# EasyEDA Pro project car1.eprj, schematic Schematic8
Board Name: V2.0-主控板; Create Date: 2025-06-19; Page Name: P1; Project Name: car1; Schematic Name: Schematic8; Update Date: 2025-06-20; Company: 嘉立创EDA; Page Size: A4; Version: V1.0
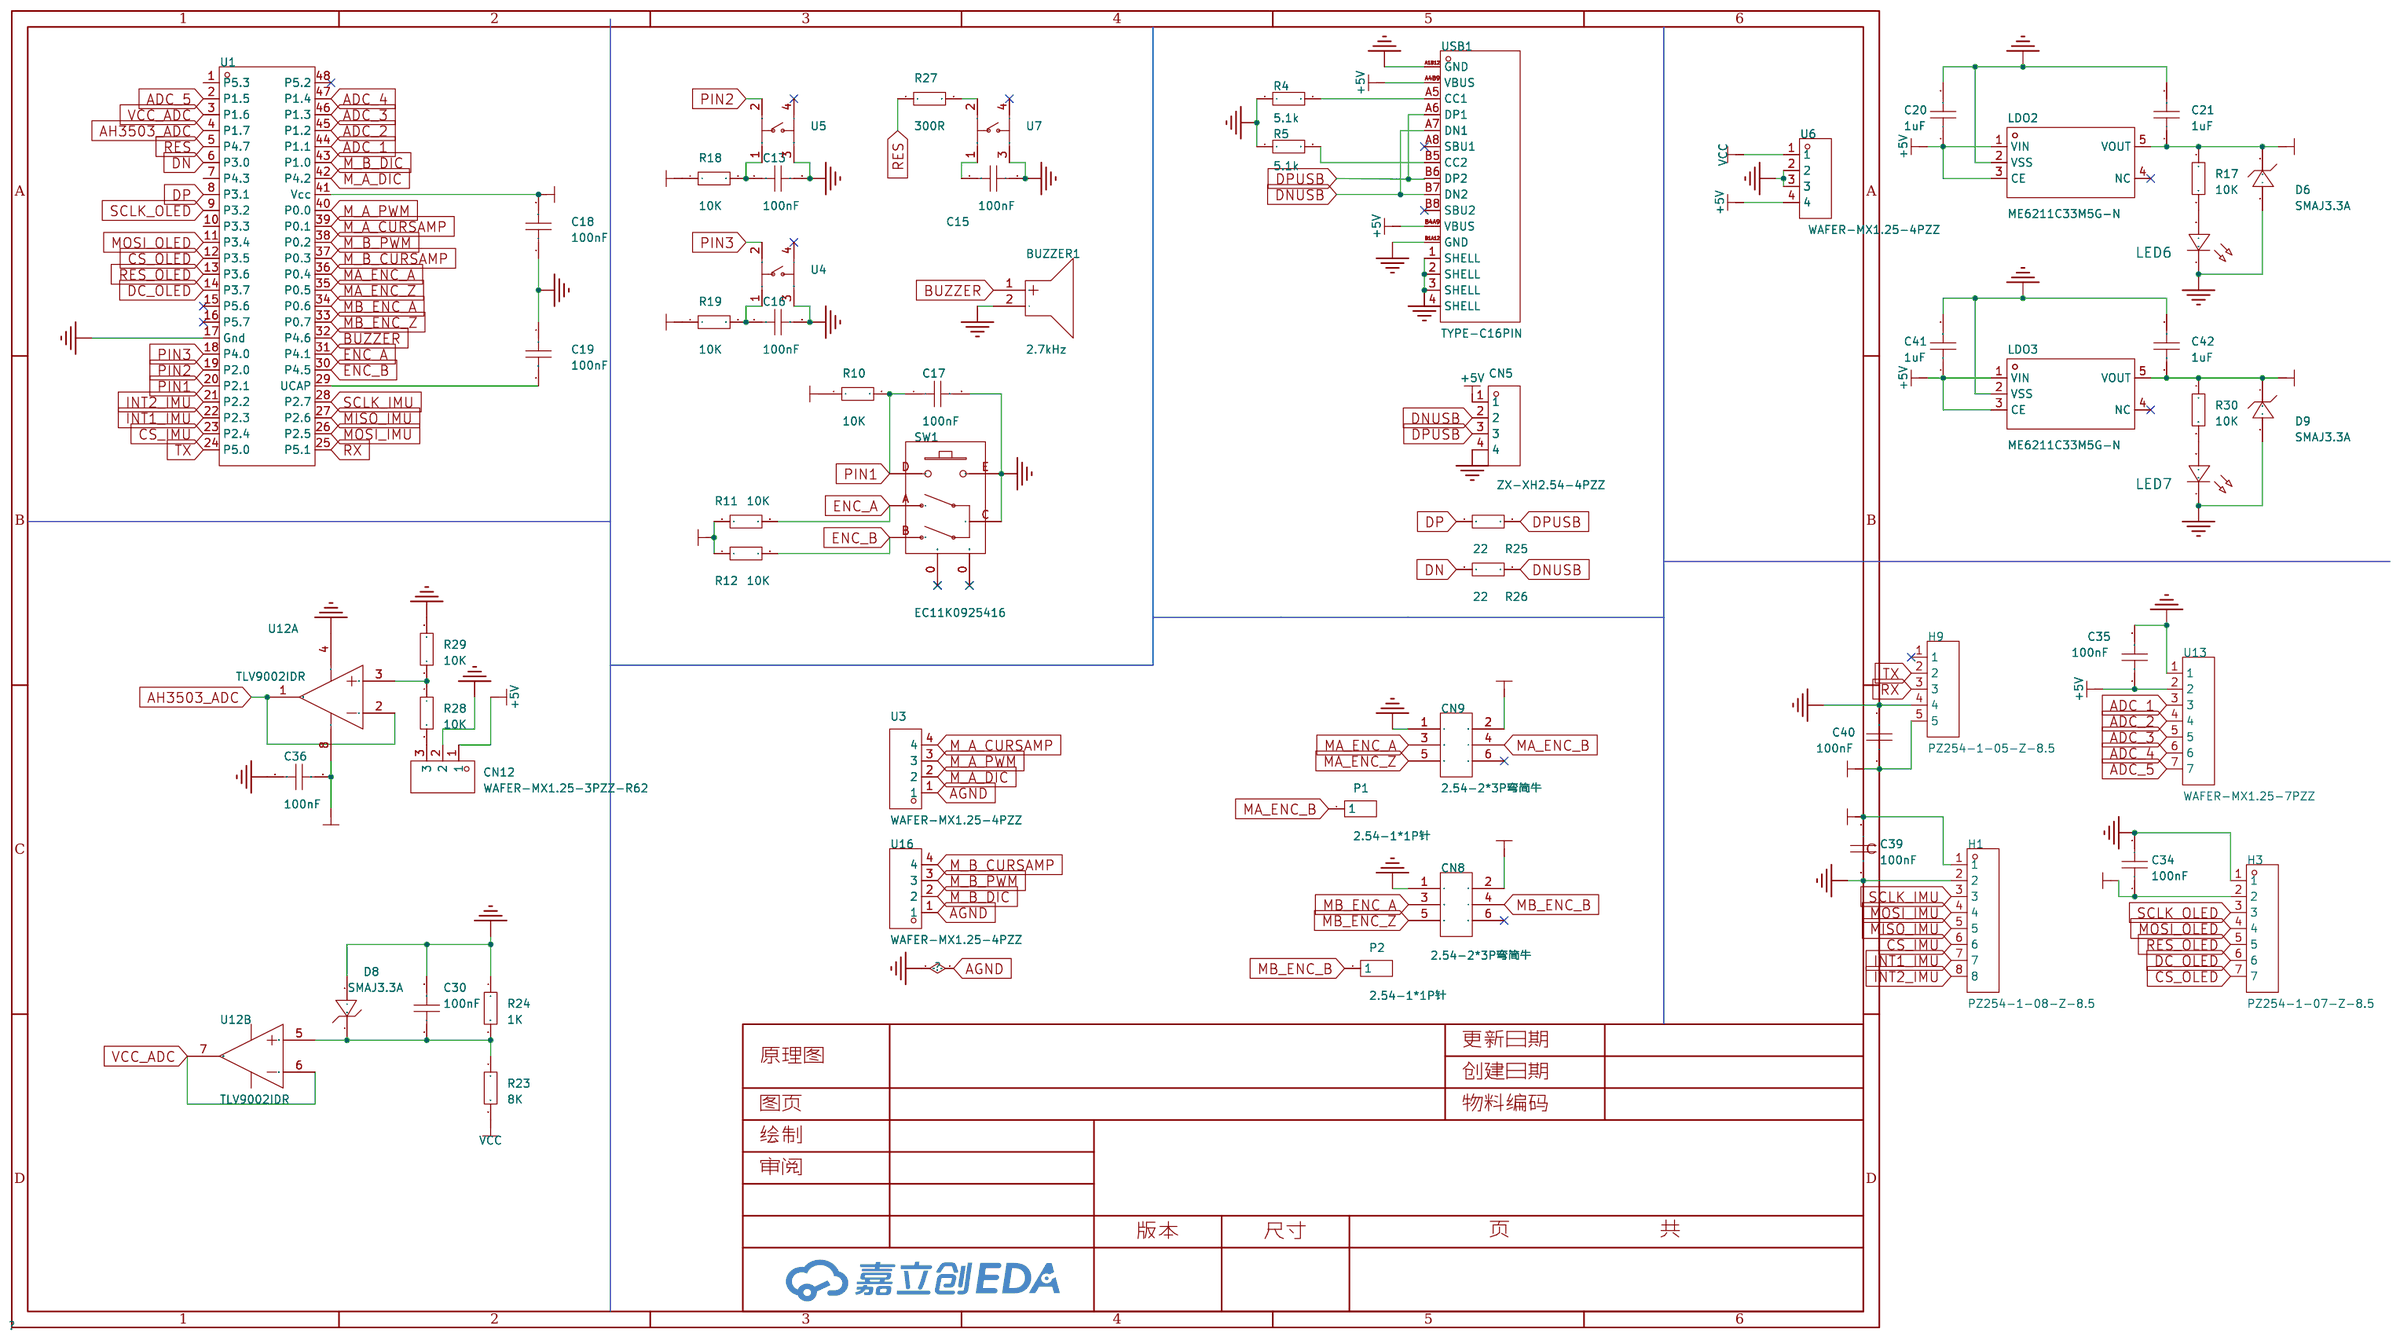
[diagram p12: schematic sheet]

## Parts
BUZZER1  2.7kHz  [BUZ-SMD_L9.6-W9.6-LS10.0-R]
C13  100nF  [C0603]
C15  100nF  [C0603]
C16  100nF  [C0603]
C17  100nF  [C0603]
C18  100nF  [C0603]
C19  100nF  [C0603]
C20  1uF  [C0603]
C21  1uF  [C0603]
C30  100nF  [C0603]
C34  100nF  [C0603]
C35  100nF  [C0603]
C36  100nF  [C0603]
C39  100nF  [C0603]
C40  100nF  [C0603]
C41  1uF  [C0603]
C42  1uF  [C0603]
CN5  ZX-XH2.54-4PZZ  [CONN-TH_4P-P2.50_4PIN]
CN8  2.54-2*3P弯简牛  [IDC-TH_6P-P2.54-H-R2-C3-S2.54]
CN9  2.54-2*3P弯简牛  [IDC-TH_6P-P2.54-H-R2-C3-S2.54]
CN12  WAFER-MX1.25-3PZZ-R62  [CONN-TH_3P-P1.25_WAFER-MX1.25-3PZZ]
D6  SMAJ3.3A  [SMA_L4.3-W2.7-LS5.1-RD]
D8  SMAJ3.3A  [SMA_L4.3-W2.7-LS5.1-RD]
D9  SMAJ3.3A  [SMA_L4.3-W2.7-LS5.1-RD]
H1  PZ254-1-08-Z-8.5  [HDR-TH_8P-P2.54-V-M]
H3  PZ254-1-07-Z-8.5  [HDR-TH_07P-P2.54-V-M]
H9  PZ254-1-05-Z-8.5  [HDR-TH_5P-P2.54-V-M]
LDO2  ME6211C33M5G-N  [SOT-23-5_L3.0-W1.7-P0.95-LS2.8-BL]
LDO3  ME6211C33M5G-N  [SOT-23-5_L3.0-W1.7-P0.95-LS2.8-BL]
LED6  -  [LED_0603]
LED7  -  [LED_0603]
P1  2.54-1*1P针  [HDR-TH_1P-P2.54-V-M]
P2  2.54-1*1P针  [HDR-TH_1P-P2.54-V-M]
R4  5.1k  [R0603]
R5  5.1k  [R0603]
R10  10K  [R0603]
R11  10K  [R0603]
R12  10K  [R0603]
R17  10K  [R0603]
R18  10K  [R0603]
R19  10K  [R0603]
R23  8K  [R0603]
R24  1K  [R0603]
R25  22  [R0603]
R26  22  [R0603]
R27  300R  [R0603]
R28  10K  [R0603]
R29  10K  [R0603]
R30  10K  [R0603]
SW1  EC11K0925416  [SW-TH_EC11K0925416]
U1  AI8051U-34K64-QFP48  [LQFP-48_L7.0-W7.0-P0.50-LS9.0-BL_1]
U3  WAFER-MX1.25-4PZZ  [CONN-TH_4P-P1.25_WAFER-MX1.25-4PZZ]
U4  TC-6610 6*6*5 160g  [SW-TH_4P-L6.0-W6.0-P4.50-LS6.5]
U5  TC-6610 6*6*5 160g  [SW-TH_4P-L6.0-W6.0-P4.50-LS6.5]
U6  WAFER-MX1.25-4PZZ  [CONN-TH_4P-P1.25_WAFER-MX1.25-4PZZ]
U7  TC-6610 6*6*5 160g  [SW-TH_4P-L6.0-W6.0-P4.50-LS6.5]
U12  TLV9002IDR  [SOIC-8_L4.9-W3.9-P1.27-LS6.0-BL]  (sections 1,2)
U13  WAFER-MX1.25-7PZZ  [CONN-TH_7P-P1.25_XUNPU_WAFER-MX1.25-7PZZ]
U16  WAFER-MX1.25-4PZZ  [CONN-TH_4P-P1.25_WAFER-MX1.25-4PZZ]
USB1  TYPE-C16PIN  [USB-C-SMD_TYPE-C16PIN]

## Library data of the parts
BUZZER1 = YS-SBZ9650DYB05: 驱动方式:有源(内含驱动线路);频率:2.7kHz;声压(SPL):80dB;; LCSC Part Name: 贴片有源蜂鸣器5V; Supplier Part: C409830; Manufacturer: Fengming(锋鸣电子); Supplier Footprint: SMD,9.6x9.6mm; JLCPCB Part Class: 扩展库; Datasheet: https://atta.szlcsc.com/upload/public/pdf/source/20191217/C409830_8EC3C70066086F723D62F9967ED58A07.pdf; Supplier: LCSC; Driver Circuitry: 有源(内含驱动线路); Voltage - Supply: 3V~7V; Sound Pressure Level(SPL): 80dB; Length: 9.6mm; Width: 9.6mm; Height: 5.3mm
C13 C15-C21 C41 C42 = CAP_0402: Supplier Footprint: 0402
C30 C34-C36 C39 C40 = CAP_0603: Supplier Footprint: 0603
CN5 = ZX-XH2.54-4PZZ: 插针结构:1x4P;间距:2.54mm;安装方式:直插;参考系列:XH;总PIN数:4P;排数:1;每排PIN数:4;行距:-;额定电流:3A;触头材质:黄铜;触头镀层:锡;工作温度范围:-25℃~+85℃;; Supplier Part: C7429634; Manufacturer: Megastar(兆星); Supplier Footprint: 插件,P=2.5mm; JLCPCB Part Class: 扩展库; Datasheet: https://atta.szlcsc.com/upload/public/pdf/source/20230619/B529A2163E0159A644AB3383D208FB03.pdf; Supplier: LCSC; Pins Structure: 1x4P; Pitch: 2.54mm; Mounting Style: 直插; Reference Series: XH; Number of Pins: 4P; Number of Rows: 1; Number of PINs Per Row: 4; Current Rating (Max): 3A; Contact Material: 黄铜; Contact Plating: 锡; Operating Temperature Range: -25℃~+85℃
CN8 CN9 = 2.54-2*3P弯简牛: 连接器类型:简牛座;间距:2.54mm;结构:2x3P;封装形式:弯插;行距:2.54mm;排数:2;每排PIN数:3;触头材质:-;触头镀层:-;; LCSC Part Name: 2.54mm 2x3P 排数:2 每排P数:3; Supplier Part: C34945; Manufacturer: BOOMELE(博穆精密); Supplier Footprint: 弯插,P=2.54mm; JLCPCB Part Class: 扩展库; Datasheet: https://atta.szlcsc.com/upload/public/pdf/source/20151118/1457707580629.pdf; Supplier: LCSC; Connector Type: 简牛座; Pitch: 2.54mm; Structure: 2x3P; Holder Type: 弯插; Row Spacing: 2.54mm; Number of Rows: 2; Pin Number in each Row: 3
CN12 = WAFER-MX1.25-3PZZ-R62: 插针结构:1x3P;间距:1.25mm;安装方式:直插;参考系列:PicoBlade(MX 1.25);总PIN数:3P;排数:1;每排PIN数:3;行距:-;额定电流:-;触头材质:铜合金;触头镀层:锡;工作温度:-25℃~+85℃;; LCSC Part Name: 1x3P 间距:1.25mm 直插 系列:PicoBlade(MX 1.25); Supplier Part: C22390408; Manufacturer: XUNPU(讯普); Supplier Footprint: 插件,P=1.25mm; JLCPCB Part Class: 扩展库; Datasheet: https://atta.szlcsc.com/upload/public/pdf/source/20240428/D061562BA5A9714D4862CFA880116A9B.pdf; Supplier: LCSC; Pins Structure: 1x3P; Pitch: 1.25mm; Mounting Type: 直插; Reference Series: PicoBlade(MX 1.25); Number of Pins: 3P; Number of Rows: 1; Number of PINs Per Row: 3; Contact Material: 铜合金; Contact Plating: 锡; Operating Temperature: -25℃~+85℃; Voltage Rating: 125V; Plastic Material: PA66; Flame Retardant Rating: UL94V-2; Color: 红色; Z-Height of the Board: 4.7mm; Y-Width of Bottom Edge on Board: 3.2mm
D6 D8 D9 = SMAJ3.3A: 反向截止电压(Vrwm):3.3V;钳位电压:8.3V;峰值脉冲电流(Ipp):25A;击穿电压:4.2V;; LCSC Part Name: 单向TVS 3.3V截止 25A峰值脉冲; Supplier Part: C2917853; Manufacturer: ZHIDE(志得); Supplier Footprint: SMA; JLCPCB Part Class: 扩展库; Datasheet: https://atta.szlcsc.com/upload/public/pdf/source/20211123/CCA4B0E600B5A566CDC39785DC4CF110.pdf; Supplier: LCSC; Reverse Stand-Off Voltage (Vrwm): 3.3V; Clamping Voltage: 8.3V; Peak Pulse Current (Ipp): 25A; Voltage - Breakdown: 4.2V; Reverse Leakage Current (Ir): 200uA; Type: TVS
H1 = PZ254-1-08-Z-8.5: 插针结构:1x8P;间距:2.54mm;行距:-;圆针/方针:方针;安装类型:直插;排数:单排;总PIN位数:8P;额定电流:3A;额定电压:-;配合针长度:6mm;塑高:2.5mm;端接针长度:3mm;触头材质:黄铜;工作温度范围:-40℃~+105℃;焊接温度(最大值):260℃@10S;颜色:黑色;; LCSC Part Name: 1x8P 间距:2.54mm 方针 直插; Supplier Part: C2894931; Manufacturer: HCTL(华灿天禄); Supplier Footprint: 插件,P=2.54mm; JLCPCB Part Class: 扩展库; Datasheet: https://atta.szlcsc.com/upload/public/pdf/source/20240305/0F0A2A5C422E5D195558C9C26715A031.pdf; Supplier: LCSC; Pin Structure: 1x8P; Pitch: 2.54mm; Circluar Pins/Square Pins: 方针; Mounting Type: 直插; Number of Rows: 单排; Number of Pins: 8P; Current Rating (Max): 3A; Length of Mating Pin: 6mm; Insulation Height: 2.5mm; Length of End Connection Pin: 3mm; Contact Material: 黄铜; Operating Temperature Range: -40℃~+105℃; Soldering Temperature(Max): 260℃@10S; Color: 黑色
H3 = PZ254-1-07-Z-8.5: 插针结构:1x7P;间距:2.54mm;行距:-;圆针/方针:方针;安装类型:直插;排数:单排;总PIN位数:7P;额定电流:3A;额定电压:-;配合针长度:6mm;塑高:2.5mm;端接针长度:3mm;触头材质:黄铜;工作温度范围:-40℃~+105℃;焊接温度(最大值):260℃@10S;颜色:黑色;; LCSC Part Name: 1x7P 间距:2.54mm 方针 直插; Supplier Part: C2894930; Manufacturer: HCTL(华灿天禄); Supplier Footprint: 插件,P=2.54mm; JLCPCB Part Class: 扩展库; Datasheet: https://atta.szlcsc.com/upload/public/pdf/source/20240305/0F0A2A5C422E5D195558C9C26715A031.pdf; Supplier: LCSC; Pin Structure: 1x7P; Pitch: 2.54mm; Circluar Pins/Square Pins: 方针; Mounting Type: 直插; Number of Rows: 单排; Number of Pins: 7P; Current Rating (Max): 3A; Length of Mating Pin: 6mm; Insulation Height: 2.5mm; Length of End Connection Pin: 3mm; Contact Material: 黄铜; Operating Temperature Range: -40℃~+105℃; Soldering Temperature(Max): 260℃@10S; Color: 黑色
H9 = PZ254-1-05-Z-8.5: 插针结构:1x5P;间距:2.54mm;行距:-;圆针/方针:方针;安装方式:直插;排数:单排;总PIN位数:5P;额定电流:3A;额定电压:-;配合针长度:6mm;塑高:2.5mm;端接针长度:3mm;触头材质:黄铜;工作温度:-40℃~+105℃;颜色:黑色;; LCSC Part Name: 1x5P 间距:2.54mm 方针 直插; Supplier Part: C2894928; Manufacturer: HCTL(华灿天禄); Supplier Footprint: 插件,P=2.54mm; JLCPCB Part Class: 扩展库; Datasheet: https://atta.szlcsc.com/upload/public/pdf/source/20240305/0F0A2A5C422E5D195558C9C26715A031.pdf; Supplier: LCSC; Pin Structure: 1x5P; Pitch: 2.54mm; Circluar Pins/Square Pins: 方针; Mounting Type: 直插; Number of Rows: 单排; Number of Pins: 5P; Current Rating: 3A; Length of Mating Pin: 6mm; Insulation Height: 2.5mm; Length of End Connection Pin: 3mm; Contact Material: 黄铜; Operating Temperature: -40℃~+105℃; Color: 黑色
LDO2 LDO3 = ME6211C33M5G-N: 输出类型:固定;最大输入电压:6V;输出电压:3.3V;最大输出电流:500mA;电源纹波抑制比(PSRR):70dB;输出极性:正极;; LCSC Part Name: 输入6V 输出3.3V 500mA; Supplier Part: C82942; Manufacturer: MICRONE(南京微盟); Supplier Footprint: SOT-23-5; JLCPCB Part Class: 扩展库; Datasheet: https://atta.szlcsc.com/upload/public/pdf/source/20170918/C82942_1505727073070976520.pdf; Supplier: LCSC; Output Type: 固定; Maximum Input Voltage: 6V; Output Voltage: 3.3V; MAX Output Current: 500mA; Power Supply Rejection Ratio (PSRR): 70dB; Dropout Voltage: 260mV@(200mA); Output Polarity: 正极; Number of Outputs: 1
LED6 LED7 = LED_0603-R: Supplier Footprint: 0603
P1 P2 = 2.54-1*1P针: 插针结构:-;间距:-;行距:-;圆针/方针:-;安装方式:直插;排数:单排;总PIN位数:1P;额定电流:-;额定电压:-;配合针长度:-;塑高:-;触头材质:-;触头镀层:-;颜色:黑色;; LCSC Part Name: 直插; Supplier Part: C81276; Manufacturer: BOOMELE(博穆精密); Supplier Footprint: 插件,P=2.54mm; JLCPCB Part Class: 扩展库; Datasheet: https://atta.szlcsc.com/upload/public/pdf/source/20221018/3E9408392E35E6F57A28985E5F7BF5C9.pdf; Supplier: LCSC; Mounting Type: 直插; Number of Rows: 单排; Number of Pins: 1P; Color: 黑色
R4 R5 R10-R12 R17 R30 = Res_0402: Supplier Footprint: 0402
R18 R19 R23-R29 = Res_0603: Supplier Footprint: 0603
SW1 = EC11K0925416: Supplier Part: C219777; Manufacturer: ALPSALPINE(阿尔卑斯阿尔派); Supplier Footprint: 插件; JLCPCB Part Class: 扩展库; Datasheet: https://atta.szlcsc.com/upload/public/pdf/source/20220222/29C2476E448AF88AA1E99A46D9435970.pdf; Supplier: LCSC
U1 = AI8051U-34K64-QFP48: 硬件浮点/硬件三角函数 跑100MHz, 32位8051-CPU 跑 42MHz，PWM 有硬件移相功能，DMA支持外设到外设，DMA支持PWM; Supplier Part: C41427635; Manufacturer: STC; Supplier Footprint: QFP-48; JLCPCB Part Class: 扩展库; Datasheet: https://atta.szlcsc.com/upload/public/pdf/source/20241012/98E0A3F17C9CC280218AE3F266CCDE47.pdf; Supplier: LCSC
U3 U6 U16 = WAFER-MX1.25-4PZZ: 插针结构:1x4P;间距:1.25mm;安装方式:直插;参考系列:PicoBlade(MX 1.25);总PIN数:4P;排数:1;每排PIN数:4;行距:-;额定电流:1A;触头材质:黄铜;触头镀层:-;工作温度:-25℃~+85℃;; LCSC Part Name: 1x4P 间距:1.25mm 直插 系列:PicoBlade(MX 1.25); Supplier Part: C3029397; Manufacturer: XUNPU(讯普); Supplier Footprint: 插件,P=1.25mm; JLCPCB Part Class: 扩展库; Datasheet: https://atta.szlcsc.com/upload/public/pdf/source/20220527/74EE44A637E2E6AE073051F308D41465.pdf; Supplier: LCSC; Pins Structure: 1x4P; Pitch: 1.25mm; Mounting Type: 直插; Reference Series: PicoBlade(MX 1.25); Number of Pins: 4P; Number of Rows: 1; Number of PINs Per Row: 4; Current Rating: 1A; Contact Material: 黄铜; Operating Temperature: -25℃~+85℃; Voltage Rating: 125V; Plastic Material: LCP; Color: 米色; Z-Height of the Board: 4.6mm; Y-Width of Bottom Edge on Board: 3.3mm
U4 U5 U7 = TC-6610 6*6*5 160g: 轻触开关  6*6*5 160g力 4.3基座 复银 耐温 ROHS; Supplier Part: C7528706; Manufacturer: FG(富港); Supplier Footprint: 插件,6x6mm; JLCPCB Part Class: 扩展库; Datasheet: https://atta.szlcsc.com/upload/public/pdf/source/20240119/C4B5B07B03893BE63D1CA58047A0B7F3.pdf; Supplier: LCSC
U12 = TLV9002IDR: 放大器数:双路;轨到轨:-;增益带宽积(GBP):-;输入失调电压(Vos):1.6mV;压摆率(SR):2V/us;输入偏置电流(Ib):5pA;; Supplier Part: C398360; Manufacturer: TI(德州仪器); Supplier Footprint: SOIC-8; JLCPCB Part Class: 扩展库; Datasheet: https://www.ti.com/cn/lit/gpn/tlv9001; Supplier: LCSC; Number of Channels: 双路; Maximum Power Supply Range (Vdd-Vss): 5.5V; Vos - Input Offset Voltage: 1.6mV; Input Offset Voltage Drift(Vos TC): 0.6uV/℃; Slew Rate: 2V/us; Ib - Input Bias Current: 5pA; Noise density(eN): 4.7nV/√Hz@1kHz; Common Mode Rejection Ratio(CMRR): 86dB; Operating Temperature: -40℃~+125℃; Single supply: 1.8V~5.5V
U13 = WAFER-MX1.25-7PZZ: 插针结构:1x7P;间距:1.25mm;安装方式:直插;参考系列:PicoBlade(MX 1.25);总PIN数:7P;排数:1;每排PIN数:7;行距:-;额定电流:1A;触头材质:黄铜;触头镀层:-;工作温度:-25℃~+85℃;; LCSC Part Name: 1x7P 间距:1.25mm 直插 系列:PicoBlade(MX 1.25); Supplier Part: C3029400; Manufacturer: XUNPU(讯普); Supplier Footprint: 插件,P=1.25mm; JLCPCB Part Class: Extended Part; Datasheet: https://atta.szlcsc.com/upload/public/pdf/source/20220527/74EE44A637E2E6AE073051F308D41465.pdf; Supplier: LCSC; Pins Structure: 1x7P; Pitch: 1.25mm; Mounting Type: 直插; Reference Series: PicoBlade(MX 1.25); Number of Pins: 7P; Number of Rows: 1; Number of PINs Per Row: 7; Current Rating: 1A; Contact Material: 黄铜; Operating Temperature: -25℃~+85℃; Voltage Rating: 125V; Plastic Material: LCP; Color: 米色; Z-Height of the Board: 4.6mm; Y-Width of Bottom Edge on Board: 3.3mm
USB1 = TYPE-C16PIN: 连接器类型:Type-C;标准:USB 3.1;公母:母;安装方式:卧贴;触点数量:16P;端口数量:1;额定电流 - 电源:3A;工作温度范围:-40℃~+85℃;; LCSC Part Name: Type-C 母 卧贴; Supplier Part: C393939; Manufacturer: SHOU HAN(首韩); Supplier Footprint: SMD; JLCPCB Part Class: 扩展库; Datasheet: https://atta.szlcsc.com/upload/public/pdf/source/20190521/C393939_7B9043D4CF1026AF443AB60D91FBCD5C.pdf; Supplier: LCSC; Connector Type: Type-C; Standard: USB 3.1; Gender: 母; Mounting Style: 卧贴; Number of Contacts: 16P; Number of Ports: 1; Current Rating - Power (Max): 3A; Operating Temperature Range: -40℃~+85℃; Rated Voltage (Max): 30V; Connect-Disconnect Life: 1万次; Core Colour: 黑色

## Nets
3.3V: C21.1 C39.2 C40.1 CN8.2 CN9.2 D6.1(C) H1.1 H9.5 LDO2.5(VOUT) R17.1
3.3V_1: C18.2 C34.1 C36.2 C42.1 D9.1(C) H3.2 LDO3.5(VOUT) R10.1 R11.1 R12.1 R18.1 R19.1 R30.1 U1.41(Vcc) U12.8(V+)
+5V: C20.1 C35.1 C41.1 CN5.1 CN12.1 LDO2.1(VIN) LDO2.3(CE) LDO3.1(VIN) LDO3.3(CE) U6.4 U13.2 USB1.A4B9(VBUS) USB1.B4A9(VBUS)
GND: BUZZER1.2(-) C13.2 C15.2 C16.2 C17.2 C18.1 C19.1 C20.2 C21.2 C30.2 C34.2 C35.2 C36.1 C39.1 C40.2 C41.2 C42.2 CN5.4 CN8.1 CN9.1 CN12.2 D6.2(A) D8.2(A) D9.2(A) H1.2 H3.1 H9.4 LDO2.2(VSS) LDO3.2(VSS) LED6.1(C) LED7.1(C) R4.1 R5.1 R24.1 R29.2 SW1.C SW1.E U1.17(Gnd) U3.1 U4.3 U5.3 U6.2 U6.3 U7.3 U12.4(V-) U13.1 U16.1 USB1.1(SHELL) USB1.2(SHELL) USB1.3(SHELL) USB1.4(SHELL) USB1.A1B12(GND) USB1.B1A12(GND)
VCC: R23.2 U6.1
VCC_ADC: U1.3(P1.6) U12.6(IN2-) U12.7(OUT2)
ADC_1: U1.44(P1.1) U13.3
ADC_2: U1.45(P1.2) U13.4
ADC_3: U1.46(P1.3) U13.5
ADC_4: U1.47(P1.4) U13.6
ADC_5: U1.2(P1.5) U13.7
AH3503_ADC: U1.4(P1.7) U12.1(OUT1) U12.2(IN1-)
BUZZER: BUZZER1.1(+) U1.32(P4.6)
CS_IMU: H1.6 U1.23(P2.4)
CS_OLED: H3.7 U1.12(P3.5)
DC_OLED: H3.6 U1.14(P3.7)
DN: R26.1 U1.6(P3.0)
DNUSB: CN5.2 R26.2 USB1.A7(DN1) USB1.B7(DN2)
DP: R25.1 U1.8(P3.1)
DPUSB: CN5.3 R25.2 USB1.A6(DP1) USB1.B6(DP2)
ENC_A: R11.2 SW1.A U1.31(P4.1)
ENC_B: R12.2 SW1.B U1.30(P4.5)
INT1_IMU: H1.7 U1.22(P2.3)
INT2_IMU: H1.8 U1.21(P2.2)
M_A_CURSAMP: U1.39(P0.1) U3.4
M_A_DIC: U1.42(P4.2) U3.2
M_A_PWM: U1.40(P0.0) U3.3
M_B_CURSAMP: U1.37(P0.3) U16.4
M_B_DIC: U1.43(P1.0) U16.2
M_B_PWM: U1.38(P0.2) U16.3
MA_ENC_A: CN9.3 U1.36(P0.4)
MA_ENC_B: CN9.4 P1.1
MA_ENC_Z: CN9.5 U1.35(P0.5)
MB_ENC_A: CN8.3 U1.34(P0.6)
MB_ENC_B: CN8.4 P2.1
MB_ENC_Z: CN8.5 U1.33(P0.7)
MISO_IMU: H1.5 U1.27(P2.6)
MOSI_IMU: H1.4 U1.26(P2.5)
MOSI_OLED: H3.4 U1.11(P3.4)
PIN1: C17.1 R10.2 SW1.D U1.20(P2.1)
PIN2: U1.19(P2.0) U5.2
PIN3: U1.18(P4.0) U4.2
RES: R27.1 U1.5(P4.7)
RES_OLED: H3.5 U1.13(P3.6)
RX: H9.3 U1.25(P5.1)
SCLK_IMU: H1.3 U1.28(P2.7)
SCLK_OLED: H3.3 U1.9(P3.2)
TX: H9.2 U1.24(P5.0)
$1N3270: R4.2 USB1.A5(CC1)
$1N3271: R5.2 USB1.B5(CC2)
$1N3293: C19.2 U1.29(UCAP)
$1N3342: R28.1 R29.1 U12.3(IN1+)
$1N4208: C30.1 D8.1(C) R23.1 R24.2 U12.5(IN2+)
Net-(C13-1): C13.1 R18.2 U5.1
Net-(C15-1): C15.1 U7.1
Net-(C16-1): C16.1 R19.2 U4.1
Net-(CN12-3): CN12.3 R28.2
Net-(LED6-2): LED6.2(A) R17.2
Net-(LED7-2): LED7.2(A) R30.2
Net-(R27-2): R27.2 U7.2

Not connected (* = marked no-connect by the designer): CN8 6*; CN9 6*; H9 1*; LDO2 4(NC)*; LDO3 4(NC)*; SW1 0(MH1)*; U1 1(P5.3) 7(P4.3) 10(P3.3) 15(P5.6)* 16(P5.7)* 48(P5.2)*; U4 4*; U5 4*; U7 4*; USB1 A8(SBU1)* B8(SBU2)*
